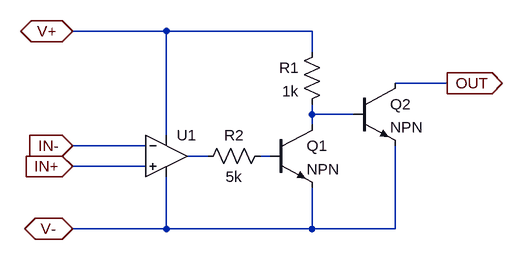
[diagram p0: schematic LM139.asc]
LM139.asc, the LTspice schematic file:
Version 4.1
SHEET 1 1516 680
WIRE 224 -16 80 -16
WIRE 448 -16 224 -16
WIRE 448 16 448 -16
WIRE 656 64 576 64
WIRE 448 112 448 96
WIRE 512 112 448 112
WIRE 448 128 448 112
WIRE 224 144 224 -16
WIRE 192 160 80 160
WIRE 288 176 256 176
WIRE 384 176 368 176
WIRE 192 192 80 192
WIRE 224 288 224 208
WIRE 224 288 80 288
WIRE 448 288 448 224
WIRE 448 288 224 288
WIRE 576 288 576 160
WIRE 576 288 448 288
FLAG 80 160 IN-
IOPIN 80 160 In
FLAG 80 192 IN+
IOPIN 80 192 In
FLAG 80 288 V-
IOPIN 80 288 BiDir
FLAG 80 -16 V+
IOPIN 80 -16 BiDir
FLAG 656 64 OUT
IOPIN 656 64 Out
SYMBOL OpAmps\\UniversalOpAmp 224 176 R0
SYMATTR InstName U1
SYMBOL npn 384 128 R0
SYMATTR InstName Q1
SYMBOL npn 512 64 R0
SYMATTR InstName Q2
SYMBOL res 464 0 M0
SYMATTR InstName R1
SYMATTR Value 1k
SYMBOL res 384 160 R90
WINDOW 0 0 56 VBottom 2
WINDOW 3 32 56 VTop 2
SYMATTR InstName R2
SYMATTR Value 5k

The netlist it stands for:
* LM139.asc
X§U1 IN+ IN- V+ V- N002 level1 Avol=1Meg GBW=10Meg Vos=0 En=0 Enk=0 In=0 Ink=0 Rin=500Meg  ; pins In+ In- V+ V- OUT
Q1 N001 N003 V- 0 NPN
Q2 OUT N001 V- 0 NPN
R1 V+ N001 1k
R2 N003 N002 5k
.model NPN NPN
.model PNP PNP
.lib standard.bjt
.lib UniversalOpAmp1.lib
.backanno
.end